# EAGLE board PKG900000001527 (EAGLE 7.7.0)
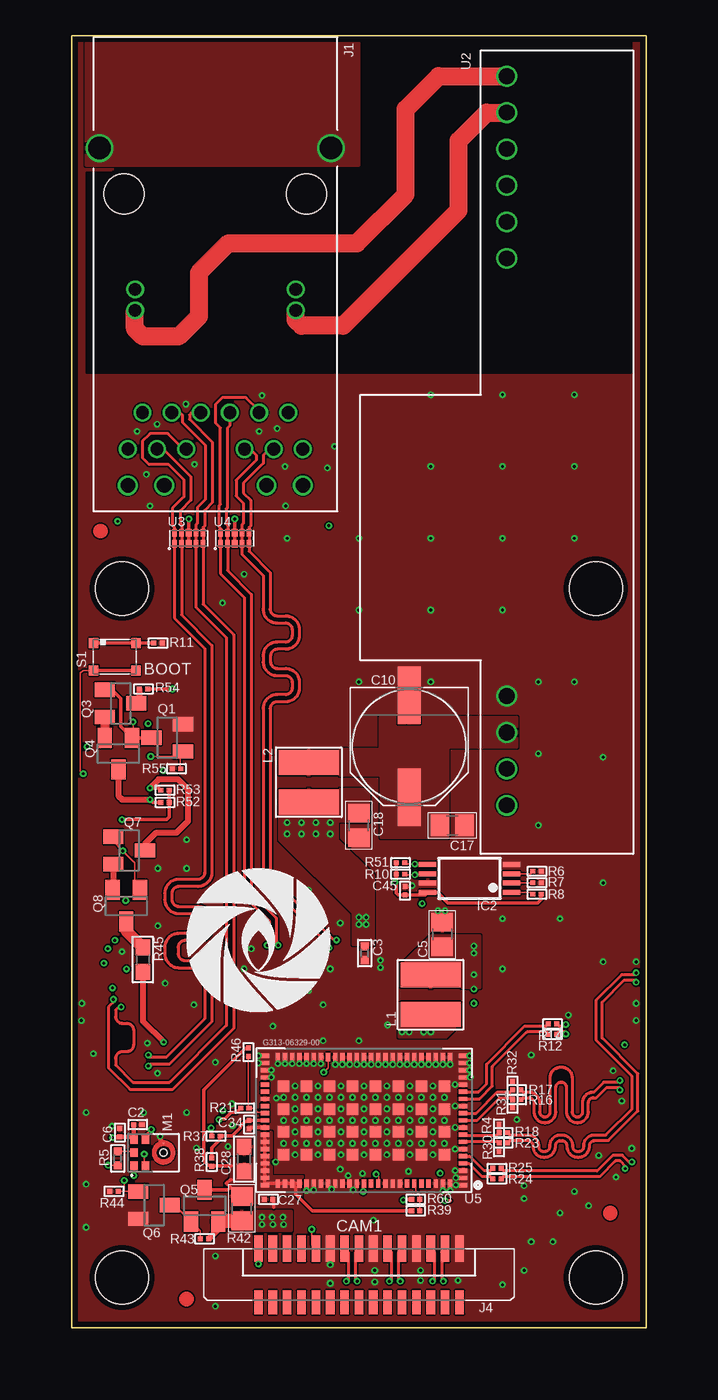
[diagram p8: board, top side]
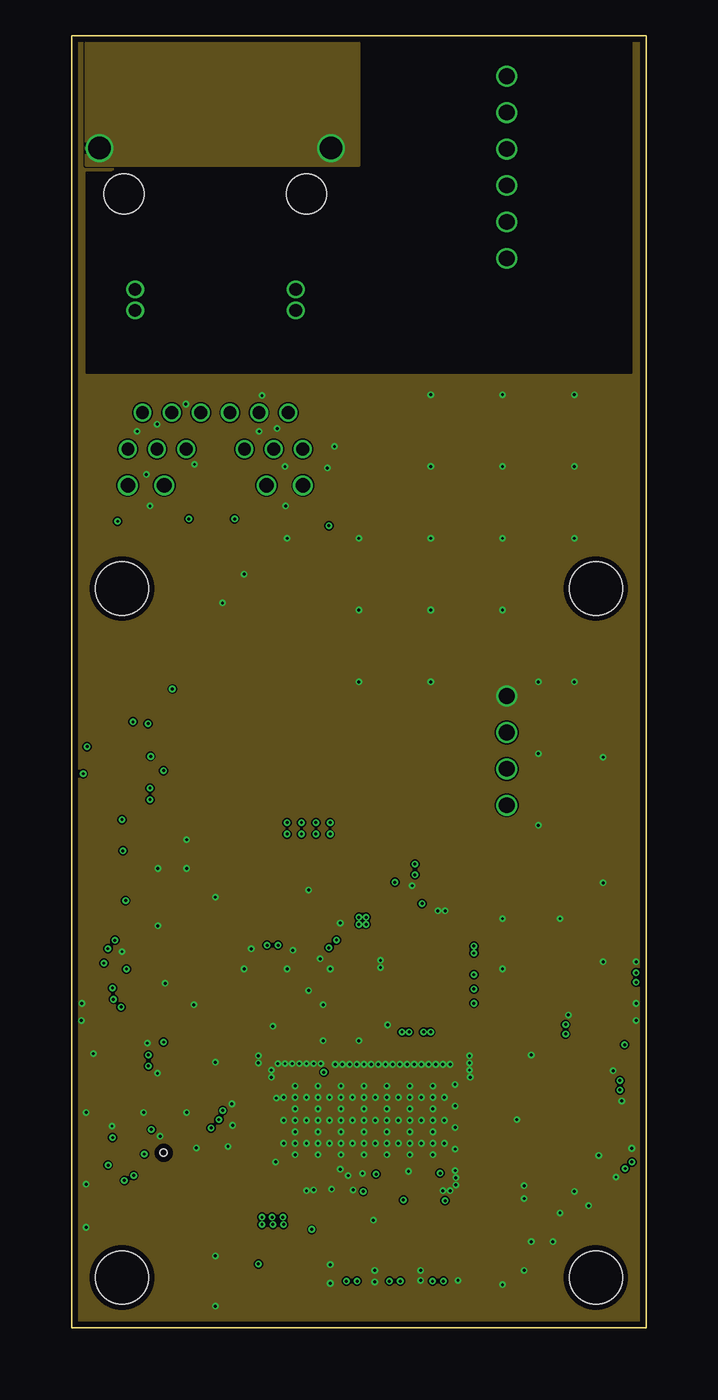
[diagram p9: board, inner layer GND]
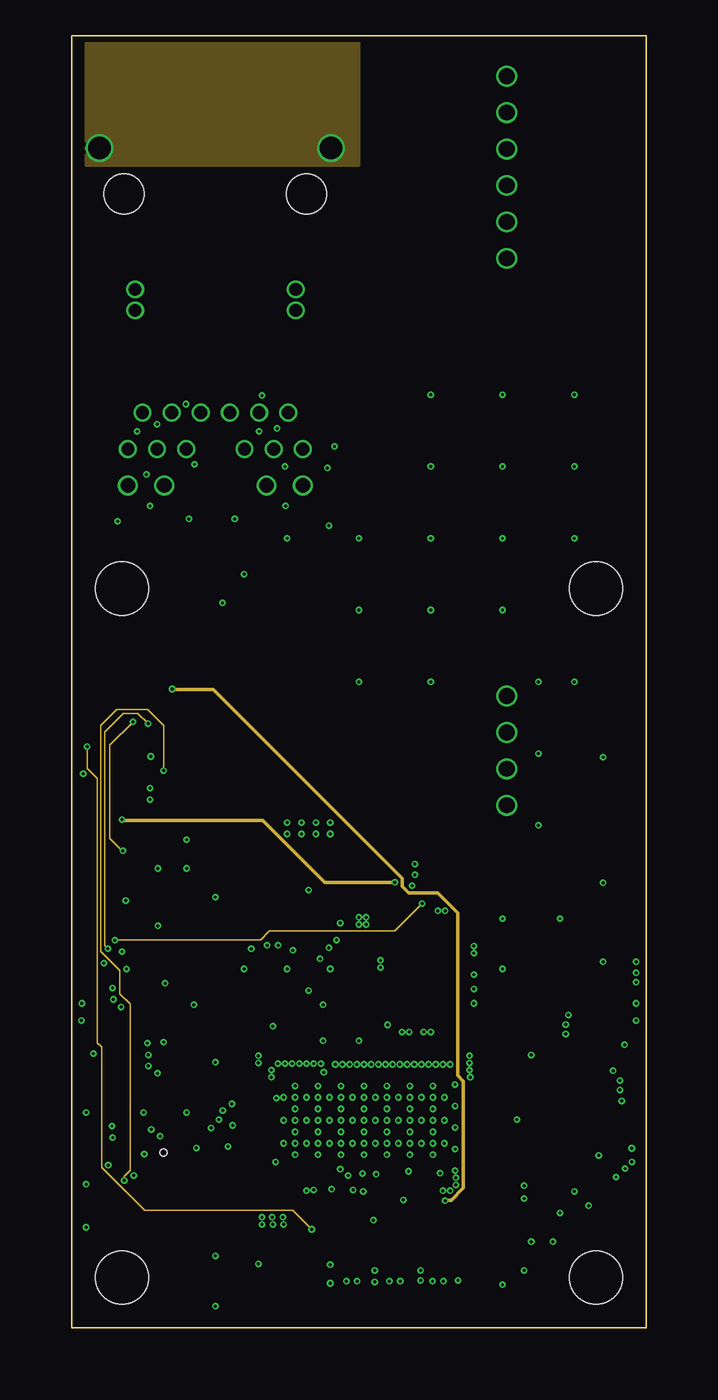
[diagram p10: board, inner layer S3]
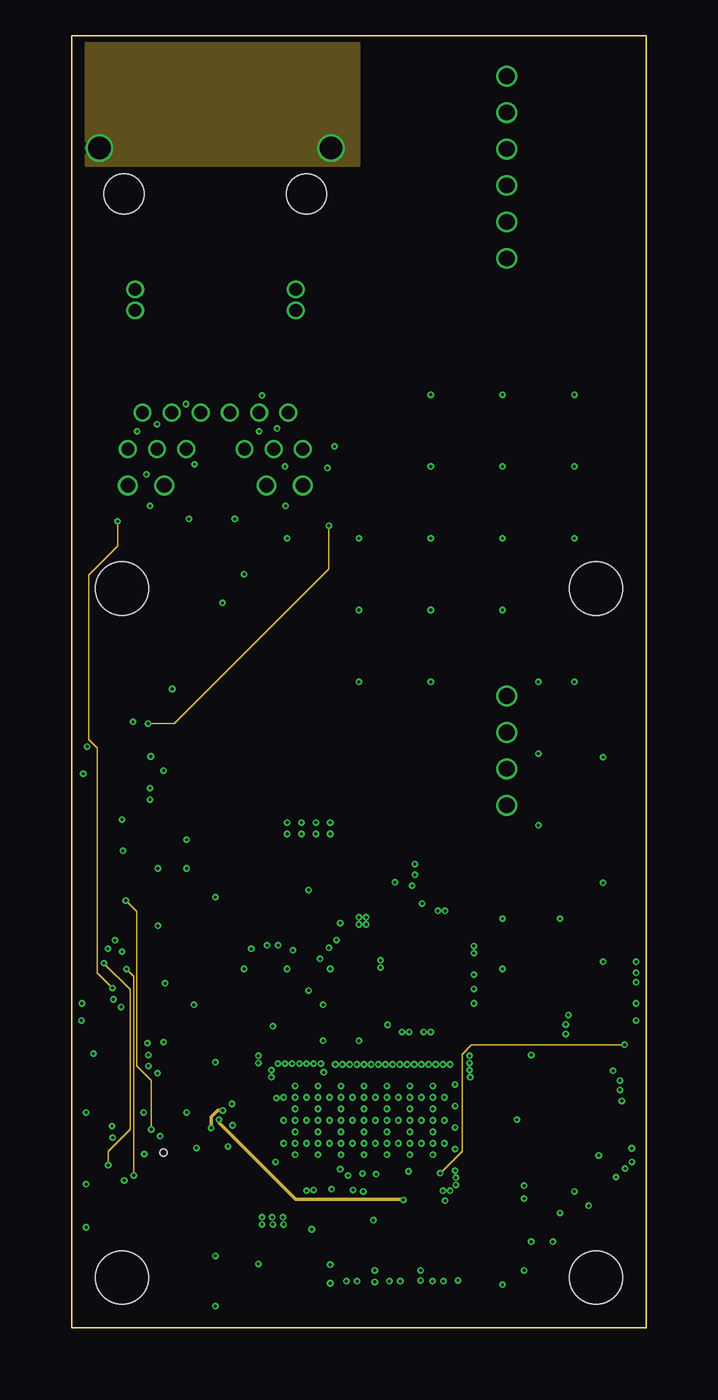
[diagram p11: board, inner layer S14]
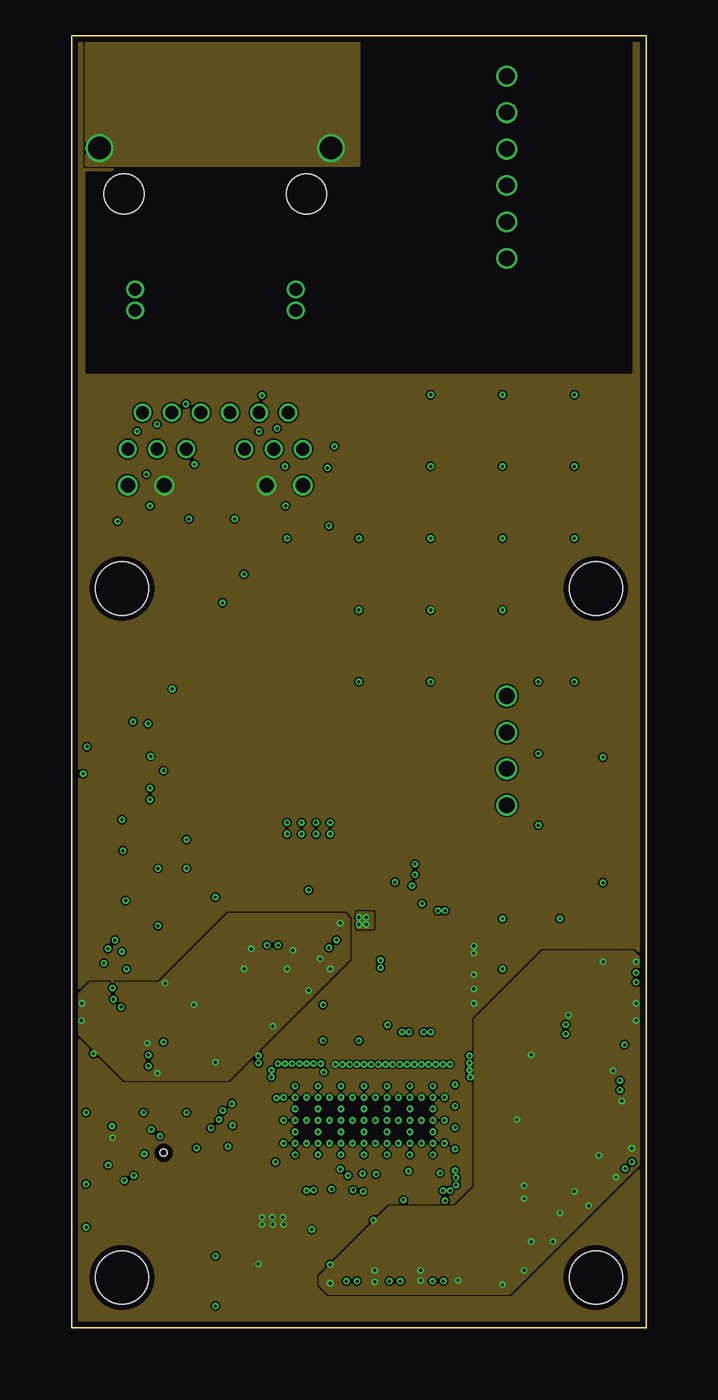
[diagram p12: board, inner layer Power]
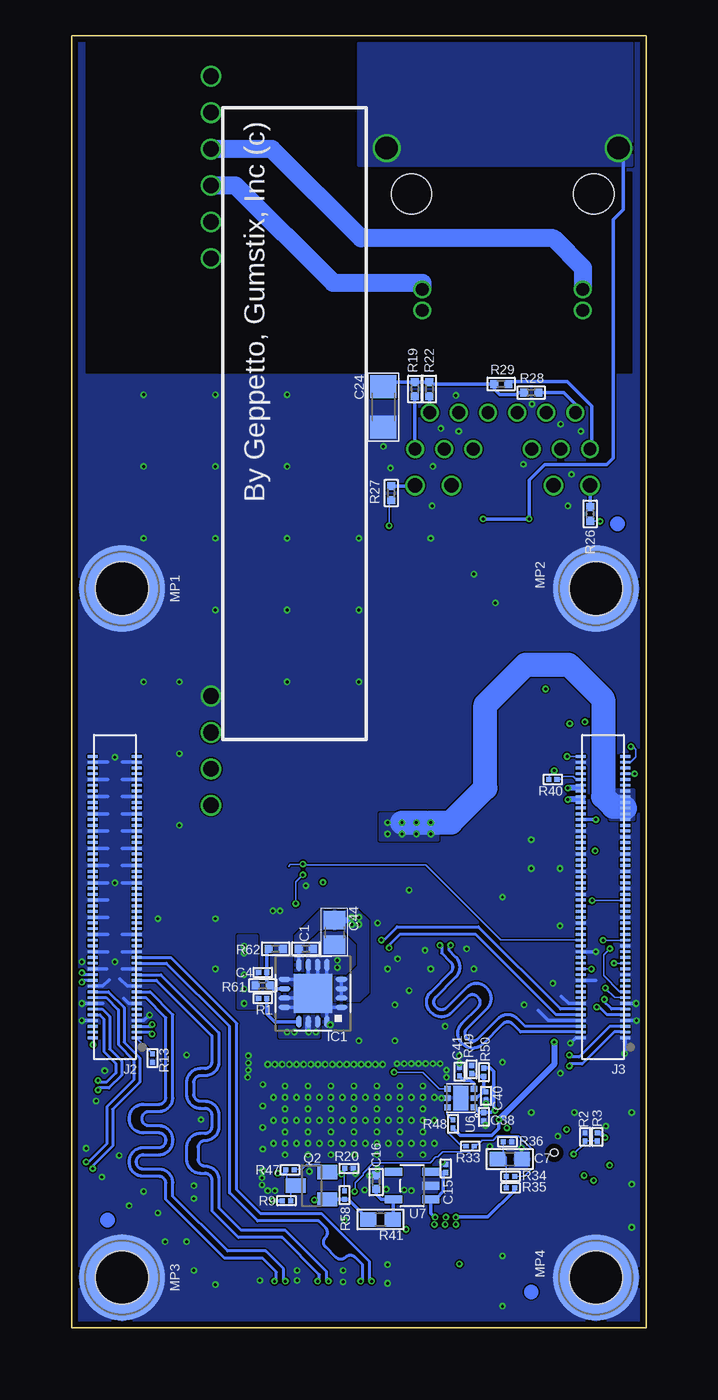
[diagram p13: board, bottom side, seen from below]

Size 40 x 90 mm. Coordinates in mm from the lower left corner, seen from the top.
Outline: 0,0 40,0 40,90 0,90 0,0
Copper layers (1+2*3+14*15+16): Top 0.035mm / dielectric 0.2mm / GND 0.035mm / dielectric 0.2mm / S3 0.035mm / dielectric 0.2mm / S14 0.035mm / dielectric 0.2mm / Power 0.035mm / dielectric 0.2mm / Bottom 0.035mm
Design rules "geppetto": minimum track width 4mil, minimum drill 8mil, track to track 4mil, track to pad 0.15mm, pad to pad 0.15mm, via to via 0.15mm, smd to smd 0mil, copper to edge 15mil, drill to drill 10mil, minimum pad ring 7mil, minimum via ring 5mil, stop-mask expansion 3mil, vias tented up to drill 20mil, thermal gap 0mil
Net classes: 1 supply: width 0.254 mm; 2 analog: width 0.178 mm; 4 xxwide: width 0.203 mm; 5 USB: width 0.2 mm, clearance 0.2 mm; 6 HDMI: width 0.2 mm, clearance 0.3 mm; 7 50_OHM: width 0.378 mm, clearance 0.3 mm
vRestrict: area 12,22 to 21.5,31.5

## Footprints (pad centres in the part's own frame; a part is rotated, then mirrored left to right if it is on the bottom)
0402 = smd 0.559 x 0.559: 1 -0.483,0; 2 0.483,0
0201 = smd 0.356 x 0.33: 1 -0.292,0; 2 0.292,0
0805 = smd 1.3 x 1.5: 1 -0.85,0; 2 0.85,0
0603 = smd 1.1 x 1: 1 -0.85,0; 2 0.85,0
PANASONIC_F = smd 4 x 1.6: + 3.55,0; - -3.55,0
1206 = smd 1.6 x 1.8: 1 -1.4,0; 2 1.4,0
PQFP16 = smd 0.85 x 0.35: 1 -1.975,0.975; 2 -1.975,0.325; 3 -1.975,-0.325; 4 -1.975,-0.975; 9 1.975,-0.975; 10 1.975,-0.325; 11 1.975,0.325; 12 1.975,0.975 | smd 0.35 x 0.85: 5 -0.975,-1.975; 6 -0.325,-1.975; 7 0.325,-1.975; 8 0.975,-1.975; 13 0.975,1.975; 14 0.325,1.975; 15 -0.325,1.975; 16 -0.975,1.975 | smd 2.7 x 2.7: P$1 0,0
TSSOP8 = smd 0.35 x 1.2: 1 -0.975,-2.925; 2 -0.325,-2.925; 3 0.325,-2.925; 4 0.975,-2.925; 5 0.975,2.925; 6 0.325,2.925; 7 -0.325,2.925; 8 -0.975,2.925
7499511440 = drill 0.89: 1 -5.075,-15.24; 2 -3.045,-15.24; 3 -1.015,-15.24; 4 1.015,-15.24; 5 3.045,-15.24; 6 5.075,-15.24; 7 -6.09,-17.78; 8 -4.06,-17.78; 9 -2.03,-17.78; 10 2.03,-17.78; 11 4.06,-17.78; 12 6.09,-17.78; 13 -5.59,-8.12; 14 5.59,-8.12; 15 -5.59,-6.66; 16 5.59,-6.66 | drill 1.02: 17 -6.095,-20.32; 18 -3.555,-20.32; 19 3.555,-20.32; 20 6.095,-20.32 | drill 1.57: SHIELD1 -8.065,3.18; SHIELD2 8.065,3.18 | hole 2.8: 6.35,0; -6.35,0
HRS_DF40C-100DS-0.4V(51) = smd 0.2 x 0.7: 1 -9.8,-1.54; 2 -9.8,1.54; 3 -9.4,-1.54; 4 -9.4,1.54; 5 -9,-1.54; 6 -9,1.54; 7 -8.6,-1.54; 8 -8.6,1.54; 9 -8.2,-1.54; 10 -8.2,1.54; 11 -7.8,-1.54; 12 -7.8,1.54; 13 -7.4,-1.54; 14 -7.4,1.54; 15 -7,-1.54; 16 -7,1.54; 17 -6.6,-1.54; 18 -6.6,1.54; 19 -6.2,-1.54; 20 -6.2,1.54; 21 -5.8,-1.54; 22 -5.8,1.54; 23 -5.4,-1.54; 24 -5.4,1.54; 25 -5,-1.54; 26 -5,1.54; 27 -4.6,-1.54; 28 -4.6,1.54; 29 -4.2,-1.54; 30 -4.2,1.54; 31 -3.8,-1.54; 32 -3.8,1.54; 33 -3.4,-1.54; 34 -3.4,1.54; 35 -3,-1.54; 36 -3,1.54; 37 -2.6,-1.54; 38 -2.6,1.54; 39 -2.2,-1.54; 40 -2.2,1.54; 41 -1.8,-1.54; 42 -1.8,1.54; 43 -1.4,-1.54; 44 -1.4,1.54; 45 -1,-1.54; 46 -1,1.54; 47 -0.6,-1.54; 48 -0.6,1.54; 49 -0.2,-1.54; 50 -0.2,1.54; 51 0.2,-1.54; 52 0.2,1.54; 53 0.6,-1.54; 54 0.6,1.54; 55 1,-1.54; 56 1,1.54; 57 1.4,-1.54; 58 1.4,1.54; 59 1.8,-1.54; 60 1.8,1.54; 61 2.2,-1.54; 62 2.2,1.54; 63 2.6,-1.54; 64 2.6,1.54; 65 3,-1.54; 66 3,1.54; 67 3.4,-1.54; 68 3.4,1.54; 69 3.8,-1.54; 70 3.8,1.54; 71 4.2,-1.54; 72 4.2,1.54; 73 4.6,-1.54; 74 4.6,1.54; 75 5,-1.54; 76 5,1.54; 77 5.4,-1.54; 78 5.4,1.54; 79 5.8,-1.54; 80 5.8,1.54; 81 6.2,-1.54; 82 6.2,1.54; 83 6.6,-1.54; 84 6.6,1.54; 85 7,-1.54; 86 7,1.54; 87 7.4,-1.54; 88 7.4,1.54; 89 7.8,-1.54; 90 7.8,1.54; 91 8.2,-1.54; 92 8.2,1.54; 93 8.6,-1.54; 94 8.6,1.54; 95 9,-1.54; 96 9,1.54; 97 9.4,-1.54; 98 9.4,1.54; 99 9.8,-1.54; 100 9.8,1.54
1-1734248-5 = smd 0.6 x 1.85: 1_1 7,0.025; 1_2 6,0.025; 1_3 5,0.025; 1_4 4,0.025; 1_5 3,0.025; 1_6 2,0.025; 1_7 1,0.025; 1_8 0,0.025; 1_9 -1,0.025; 1_10 -2,0.025; 1_11 -3,0.025; 1_12 -4,0.025; 1_13 -5,0.025; 1_14 -6,0.025; 1_15 -7,0.025 | smd 0.6 x 1.65: 2_1 7,-3.725; 2_2 6,-3.725; 2_3 5,-3.725; 2_4 4,-3.725; 2_5 3,-3.725; 2_6 2,-3.725; 2_7 1,-3.725; 2_8 0,-3.725; 2_9 -1,-3.725; 2_10 -2,-3.725; 2_11 -3,-3.725; 2_12 -4,-3.725; 2_13 -5,-3.725; 2_14 -6,-3.725; 2_15 -7,-3.725
1515 = smd 1.75 x 4.2: 1 -1.375,0; 2 1.375,0
SPH0645 = smd 0.6 x 0.522: 1 -0.9,2.074; 2 -0.9,1.252; 4 0.9,1.252; 5 0.9,2.074; 6 0,2.074 | smd 0.1 x 0.1: 3 0.65,0.02 | hole 0.5: 0,0
WA-SMSI_9774___151 = smd 6 x 6: 1 0,0 | hole 3.7: 0,0
SOT23 = smd 1 x 1.4: 1 -0.95,-1.1; 2 0.95,-1.1; 3 0,1.1
KMT0 = smd 0.65 x 0.7: 1 -1.475,0.95; 2 1.475,0.95; 3 1.475,-0.95; 4 -1.475,-0.95
AG9700 = drill 1.1: 1 1.8,1.8; 2 4.34,1.8; 3 6.88,1.8; 4 9.42,1.8; 5 11.96,1.8; 6 14.5,1.8; 7 44.98,1.8; 8 47.52,1.8; 9 50.06,1.8; 10 52.6,1.8
UFDFN-10 = smd 0.3 x 0.55: 1 -1,-0.385; 2 -0.5,-0.385; 4 0.5,-0.385; 5 1,-0.385; 6 1,0.385; 7 0.5,0.385; 9 -0.5,0.385; 10 -1,0.385 | smd 0.4 x 0.55: 3 0,-0.385; 8 0,0.385
G313-06329-00 = smd 0.6 x 0.3: 1 -6.9,4.5; 2 -6.9,4; 3 -6.9,3.5; 4 -6.9,3; 5 -6.9,2.5; 6 -6.9,2; 7 -6.9,1.5; 8 -6.9,1; 9 -6.9,0.5; 10 -6.9,0; 11 -6.9,-0.5; 12 -6.9,-1; 13 -6.9,-1.5; 14 -6.9,-2; 15 -6.9,-2.5; 16 -6.9,-3; 17 -6.9,-3.5; 18 -6.9,-4; 19 -6.9,-4.5; 45 6.9,-4.5; 46 6.9,-4; 47 6.9,-3.5; 48 6.9,-3; 49 6.9,-2.5; 50 6.9,-2; 51 6.9,-1.5; 52 6.9,-1; 53 6.9,-0.5; 54 6.9,0; 55 6.9,0.5; 56 6.9,1; 57 6.9,1.5; 58 6.9,2; 59 6.9,2.5; 60 6.9,3; 61 6.9,3.5; 62 6.9,4; 63 6.9,4.5 | smd 0.3 x 0.6: 20 -6,-4.4; 21 -5.5,-4.4; 22 -5,-4.4; 23 -4.5,-4.4; 24 -4,-4.4; 25 -3.5,-4.4; 26 -3,-4.4; 27 -2.5,-4.4; 28 -2,-4.4; 29 -1.5,-4.4; 30 -1,-4.4; 31 -0.5,-4.4; 32 0,-4.4; 33 0.5,-4.4; 34 1,-4.4; 35 1.5,-4.4; 36 2,-4.4; 37 2.5,-4.4; 38 3,-4.4; 39 3.5,-4.4; 40 4,-4.4; 41 4.5,-4.4; 42 5,-4.4; 43 5.5,-4.4; 44 6,-4.4; 64 6,4.4; 65 5.5,4.4; 66 5,4.4; 67 4.5,4.4; 68 4,4.4; 69 3.5,4.4; 70 3,4.4; 71 2.5,4.4; 72 2,4.4; 73 1.5,4.4; 74 1,4.4; 75 0.5,4.4; 76 0,4.4; 77 -0.5,4.4; 78 -1,4.4; 79 -1.5,4.4; 80 -2,4.4; 81 -2.5,4.4; 82 -3,4.4; 83 -3.5,4.4; 84 -4,4.4; 85 -4.5,4.4; 86 -5,4.4; 87 -5.5,4.4; 88 -6,4.4 | smd 0.8 x 0.8: 89 -5.6,2.4; 90 -4,2.4; 91 -2.4,2.4; 92 -0.8,2.4; 93 0.8,2.4; 94 2.4,2.4; 95 4,2.4; 96 5.6,2.4; 97 -5.6,0.8; 98 -4,0.8; 99 -2.4,0.8; 100 -0.8,0.8; 101 0.8,0.8; 102 2.4,0.8; 103 4,0.8; 104 5.6,0.8; 105 -5.6,-0.8; 106 -4,-0.8; 107 -2.4,-0.8; 108 -0.8,-0.8; 109 0.8,-0.8; 110 2.4,-0.8; 111 4,-0.8; 112 5.6,-0.8; 113 -5.6,-2.4; 114 -4,-2.4; 115 -2.4,-2.4; 116 -0.8,-2.4; 117 0.8,-2.4; 118 2.4,-2.4; 119 4,-2.4; 120 5.6,-2.4
WDFN6 = smd 0.4 x 0.45: 1 -0.65,-0.925; 2 0,-0.925; 3 0.65,-0.925; 4 0.65,0.925; 5 0,0.925; 6 -0.65,0.925 | smd 1.72 x 1.05: EPAD 0,0
SOT-23-5 = smd 0.55 x 1.2: 1 -0.95,-1.3; 2 0,-1.3; 3 0.95,-1.3; 4 0.95,1.3; 5 -0.95,1.3

## Placement (x,y rotation side)
C1  0.1uF / 16V  [0402]  23.7,26.4 0 bottom
C2  0.1uF  [0201]  4.6,14.15 0 top
C3  1.0uF  [0402]  20.4,26.1 270 top
C4  10pF  [0201]  26.7,24.75 0 bottom
C5  22uF  [0805]  25.8,27.4 90 top
C6  220pF  [0201]  3.35,13.6 90 top
C7  10uF  [0603]  9.5,11.75 0 bottom
C10  470uF  [PANASONIC_F]  23.5,40.5 270 top
C15  DNP  [0201]  13.95,11.1 90 bottom
C16  DNP  [0402]  18.8,10.15 90 bottom
C17  10uF / 16V  [0805]  26.5,35 0 top
C18  10uF / 16V  [0805]  20,35 270 top
C24  1nF 2KV  [1206]  18.3,64.15 270 bottom
C27  0.1uF  [0201]  13.7,8.95 0 top
C28  10uF  [0603]  12,11.75 90 top
C34  0.1uF  [0201]  12.35,14.15 270 top
C38  DNP  [0201]  11.3,14.7 270 bottom
C40  DNP  [0201]  11.15,16.15 270 bottom
C41  DNP  [0201]  13,17.85 90 bottom
C44  10uF / 16V  [0805]  21.7,27.55 270 bottom
C45  0.1uF  [0201]  23.2,30.45 90 top
FD1  DNP  [FIDUCIAL]  8,2 0 top
FD2  DNP  [FIDUCIAL]  2,55.5 0 top
FD3  DNP  [FIDUCIAL]  37.5,8 0 top
FD4  DNP  [FIDUCIAL]  8,2.5 0 bottom
FD5  DNP  [FIDUCIAL]  37.5,7.5 0 bottom
FD6  DNP  [FIDUCIAL]  2,56 0 bottom
IC1  TPS62111  [PQFP16]  23.2,23.3 180 bottom
IC2  CAT24C256YI-G  [TSSOP8]  27.7,31.3 90 top
J1  1000BASET_POE  [7499511440]  10,79 0 top
J2  DF40HC(3.0)-100DS-0.4V(51)  [HRS_DF40C-100DS-0.4V(51)]  37,30 90 bottom
J3  DF40HC(3.0)-100DS-0.4V(51)  [HRS_DF40C-100DS-0.4V(51)]  3,30 90 bottom
J4  FPC-15VERT  [1-1734248-5]  20,5.5 0 top
L1  6.8uH  [1515]  25,23.2 90 top
L2  2.2uH  [1515]  16.5,38 270 top
M1  SPH0645  [SPH0645]  6.4,12.2 90 top
MP1  9774030151R  [WA-SMSI_9774___151]  36.5,51.5 270 bottom
MP2  9774030151R  [WA-SMSI_9774___151]  3.5,51.5 270 bottom
MP3  9774030151R  [WA-SMSI_9774___151]  36.5,3.5 270 bottom
MP4  9774030151R  [WA-SMSI_9774___151]  3.5,3.5 270 bottom
Q1  [SOT23]  6.65,41.1 90 top
Q2  BSS138  [SOT23]  23.3,9.9 90 bottom
Q3  FDN360P  [SOT23]  3.4,43.5 270 top
Q4  FDN360P  [SOT23]  3.25,40 180 top
Q5  FDN360P  [SOT23]  9.25,8.5 0 top
Q6  BSS138  [SOT23]  5.73,8.54 270 top
Q7  FDN360P  [SOT23]  4,33.25 270 top
Q8  FDN360P  [SOT23]  3.8,29.4 180 top
R1  1M0  [0201]  26.7,22.95 180 bottom
R2  0R  [0201]  4.25,13.3 270 bottom
R3  DNP  [0201]  3.4,13.3 90 bottom
R4  0R  [0201]  29.75,13.89 270 top
R5  51R1  [0402]  3.2,11.8 90 top
R6  100K 1%  [0201]  32.4,31.8 180 top
R7  100K 1%  [0201]  32.4,31 180 top
R8  100K 1%  [0201]  32.4,30.2 180 top
R9  10K 1%  [0201]  25.05,8.85 0 bottom
R10  1K5  [0201]  22.9,31.6 180 top
R11  10K 1%  [0201]  6,47.7 180 top
R12  0R  [0201]  33.48,20.44 180 top
R13  0R  [0201]  34.38,18.79 270 bottom
R14  0R  [0201]  33.48,21.17 180 top
R16  DNP  [0201]  30.99,15.89 180 top
R17  DNP  [0201]  30.99,16.57 180 top
R18  DNP  [0201]  30.05,13.59 180 top
R19  75R  [0402]  16.1,65.4 90 bottom
R20  DNP  [0201]  20.7,11.1 180 bottom
R21  DNP  [0201]  12.05,15.3 180 top
R22  75R  [0402]  15.1,65.4 90 bottom
R23  DNP  [0201]  30.05,12.88 180 top
R24  DNP  [0201]  29.61,10.38 180 top
R25  DNP  [0201]  29.61,11.1 180 top
R26  330R  [0402]  3.9,56.7 270 bottom
R27  330R  [0402]  17.75,58.15 270 bottom
R28  75R  [0402]  8,65.15 180 bottom
R29  75R  [0402]  10.1,65.75 180 bottom
R30  0R  [0201]  29.75,12.58 90 top
R31  0R  [0201]  30.69,15.6 90 top
R32  0R  [0201]  30.69,16.87 270 top
R33  DNP  [0201]  12.25,12.65 180 bottom
R34  0R  [0201]  9.45,10.55 180 bottom
R35  100K 1%  [0201]  9.45,9.75 0 bottom
R36  100K 1%  [0201]  9.65,12.95 180 bottom
R37  DNP  [0201]  10.05,13.35 0 top
R38  0R  [0201]  9.75,11.55 270 top
R39  3K9  [0201]  23.95,8.15 0 top
R40  0R  [0201]  6.5,38.2 180 bottom
R41  DNP  [0603]  18.5,7.55 180 bottom
R42  DNP  [0805]  11.85,8.3 270 top
R43  10K 1%  [0201]  9.25,6.2 180 top
R44  10K 1%  [0201]  2.95,9.5 180 top
R45  0R  [0603]  4.95,25.65 270 top
R46  0R  [0201]  12.3,19.2 90 top
R47  DNP  [0201]  24.8,11 180 bottom
R48  DNP  [0201]  13.45,14.2 270 bottom
R49  DNP  [0201]  12.15,18 270 bottom
R50  DNP  [0201]  11.3,17.8 90 bottom
R51  1K5  [0201]  22.9,32.4 180 top
R52  0R  [0201]  6.5,36.6 0 top
R53  DNP  [0201]  6.5,37.45 0 top
R54  0R  [0201]  5,44.5 180 top
R55  10K 1%  [0201]  7.3,38.95 0 top
R58  10K 1%  [0201]  21,9.25 90 bottom
R60  DNP  [0201]  23.95,8.95 180 top
R61  0R  [0402]  26.7,23.85 180 bottom
R62  DNP  [0402]  25.8,26.4 180 bottom
S1  EVQ  [KMT0]  3,46.75 0 top
U2  AG9705-2BR  [AG9700]  28.5,89 270 top
U3  TPD4E02B0410-USON  [UFDFN-10]  8.15,55 0 top
U4  TPD4E02B0410-USON  [UFDFN-10]  11.35,55 0 top
U5  G313-06329-00  [G313-06329-00]  20.35,14.45 180 top
U6  DNP  [WDFN6]  12.9,16 90 bottom
U7  DNP  [SOT-23-5]  16.3,9.9 90 bottom
U$2  DNP  [GEPPETTO_LABEL]  29.5,85 270 bottom
U$3  DNP  [GEPPETTO_LOGO_SILK10]  13,27 0 top

## Tracks (layer width: path | path; a pad name or v marks a point on that pad's centre or on a via)
1.8V_OUT$1  (via drill 0.2)
  Top 0.254: v5.45,37.6 6.06,37.6 R53.1
  Top 0.406: Q7.3 5.1,33.7 5.9,34.5 7.3,34.5 8.1,35.3 8.1,37.5 7.4,38.2 6.05,38.2 v5.45,37.6
  Bottom 0.254: 4.54,37.6 J3.88 J3.90
  Bottom 0.406: 4.54,37.6 v5.45,37.6
1.8V_OUT_CM4
  Top 0.813: Q8.3 3.8,27.65 R45.1
1.1000BASET_LINK_1000  (via drill 0.2)
  S3 0.102: v2.52,26.41 2.29,26.64 2.29,41.52 3.58,42.81 4.6,42.81 v5.32,42.09
  S14 0.102: v5.32,42.09 7.15,42.09 17.9,52.84 v17.9,55.88
  Bottom 0.102: J3.17 1.82,23.4 2.96,24.54 2.96,25.97 v2.52,26.41 | v17.9,55.88 17.9,57.52 R27.2
1.1000BASET_LINK_ACT  (via drill 0.2)
  S14 0.102: v3.2,56.19 3.2,54.46 1.17,52.43 1.17,41 1.78,40.39 1.78,24.73 v2.83,23.67
  Bottom 0.102: v3.2,56.19 3.86,56.19 R26.2 | 1.47,23.01 J3.15 2.18,23 2.83,23.66 v2.83,23.67
1.1000BASET_TR0_N  (via drill 0.2)
  Top 0.2: J1.10 12.42,61.22 12.84,60.8 12.84,60.44 11.45,59.05 11.45,57.95 11.95,57.45 11.95,56.05 11.85,55.95 U4.7 U4.4 11.85,53.89 13.32,52.42 13.32,50.08 arc90 14.29,49.1 14.88,49.1 arc-90 15.36,48.63 15.36,48.24 arc-90 14.88,47.77 14.29,47.77 arc90 13.32,46.79 13.32,46.41 arc90 14.29,45.44 14.88,45.44 arc-90 15.36,44.96 15.36,44.58 arc-90 14.88,44.1 14.29,44.1 arc90 13.32,43.13 13.32,31.24 17.99,26.56 v17.9,26.47
  Bottom 0.2: J3.10 6.26,21.8 11.89,27.43 17.13,27.43 17.99,26.56 v17.9,26.47
1.1000BASET_TR0_P  (via drill 0.2)
  Top 0.2: J1.11 13.76,61.22 13.34,60.8 13.34,60.24 11.95,58.85 11.95,58.15 12.45,57.65 12.45,55.85 12.35,55.75 U4.6 U4.5 12.35,54.09 13.82,52.62 13.82,50.08 arc90 14.29,49.6 14.88,49.6 arc-90 15.86,48.63 15.86,48.24 arc-90 14.88,47.27 14.32,47.27 arc90 13.84,46.79 13.84,46.41 arc90 14.32,45.94 14.88,45.94 arc-90 15.86,44.96 15.86,44.58 arc-90 14.88,43.6 14.29,43.6 arc90 13.82,43.13 13.82,31.44 18.35,26.92 v18.44,27.01
  Bottom 0.2: J3.12 5.96,22.2 11.69,27.93 17.33,27.93 18.35,26.92 v18.44,27.01
1.1000BASET_TR1_N  (via drill 0.2)
  Top 0.2: J1.5 13.04,63.9 12.13,64.81 10.49,64.81 10,64.32 10,63.05 10.35,62.7 10.35,57.35 10.25,57.25 10.25,55.8 10.35,55.7 U4.10 U4.1 10.35,52.55 12.01,50.89 12.01,30.07 13.74,28.34 13.74,26.64 v13.61,26.64
  Bottom 0.2: J3.6 8.43,21 8.95,21.52 arc-90 10.33,21.52 11.74,20.11 arc90 12.41,20.11 12.47,20.18 arc90 12.47,20.85 11.06,22.26 arc-90 11.06,23.64 11.13,23.7 arc-90 12.51,23.7 13.92,22.29 arc90 14.59,22.29 14.65,22.36 arc90 14.65,23.03 13.24,24.44 arc-90 13.24,25.82 13.74,26.31 13.74,26.64 v13.61,26.64
1.1000BASET_TR1_P  (via drill 0.2)
  Top 0.2: J1.4 11.02,62.87 10.85,62.7 10.85,57.15 10.75,57.05 10.75,56 10.85,55.9 U4.9 U4.2 10.85,52.75 12.51,51.09 12.51,30.27 14.24,28.54 14.24,26.64 v14.37,26.64
  Bottom 0.2: J3.4 8.73,20.6 9.3,21.17 arc-90 9.97,21.17 11.38,19.76 arc90 12.76,19.76 12.83,19.82 arc90 12.83,21.2 11.7,22.33 arc-90 11.7,23.01 11.76,23.07 arc-90 12.43,23.07 13.56,21.94 arc90 14.94,21.94 15.01,22 arc90 15.01,23.38 13.6,24.79 arc-90 13.6,25.46 14.24,26.11 14.24,26.64 v14.37,26.64
1.1000BASET_TR2_N  (via drill 0.2)
  Top 0.2: J1.2 7.53,63.76 7.7,63.59 7.7,63.09 9.3,61.49 9.3,57.7 8.75,57.15 8.75,56.05 8.65,55.95 U3.7 U3.4 8.65,50.21 10.77,48.09 10.77,21.05 6.82,17.1 4.26,17.1 3.05,18.31 3.05,18.76 arc-90 3.52,19.23 3.83,19.23 arc90 4.31,19.71 4.31,20.73 arc90 3.83,21.21 3.52,21.21 arc-90 3.05,21.68 3.05,22.14 3.35,22.43 v3.44,22.34
  Bottom 0.2: J3.9 2.71,21.8 3.35,22.43 v3.44,22.34
1.1000BASET_TR2_P  (via drill 0.2)
  Top 0.2: J1.3 8.37,63.76 8.2,63.59 8.2,63.29 9.8,61.69 9.8,57.5 9.25,56.95 9.25,55.85 9.15,55.75 U3.6 U3.5 9.15,50.41 11.27,48.29 11.27,20.85 7.02,16.6 4.06,16.6 2.55,18.11 2.55,22.34 2.99,22.79 v2.9,22.88
  Bottom 0.2: J3.11 2.41,22.2 2.99,22.79 v2.9,22.88
1.1000BASET_TR3_N  (via drill 0.2)
  Top 0.2: J1.9 7.78,61.22 6.7,62.3 5.45,62.3 4.92,61.77 4.92,60.6 4.93,60.6 5.37,60.16 6.73,60.16 7.8,59.09 7.8,57.9 7,57.1 7,55.9 7.15,55.75 U3.10 U3.1 7.15,49.45 9.26,47.34 9.26,31.72 arc-90 8.79,31.24 7.45,31.24 arc90 6.48,30.27 6.48,29.83 arc90 7.45,28.86 8.79,28.86 arc-90 9.26,28.38 9.26,27.95 arc-90 8.79,27.47 7.45,27.47 arc90 6.48,26.5 6.48,26.06 arc90 7.45,25.09 8.79,25.09 arc-90 9.26,24.61 9.26,21.52 6.61,18.87 5.34,18.87 v5.34,19
  Bottom 0.2: J3.5 2.53,21 4.66,18.87 5.34,18.87 v5.34,19
1.1000BASET_TR3_P  (via drill 0.2)
  Top 0.2: J1.8 6.37,61.22 8.3,59.29 8.3,57.65 7.55,56.9 7.55,56.05 7.65,55.95 U3.9 U3.2 7.65,49.65 9.76,47.54 9.76,31.72 arc-90 8.79,30.74 7.45,30.74 arc90 6.98,30.27 6.98,29.83 arc90 7.45,29.36 8.79,29.36 arc-90 9.76,28.38 9.76,27.95 arc-90 8.79,26.97 7.89,26.97 arc90 7.41,26.5 7.41,26.06 arc90 7.89,25.59 8.79,25.59 arc-90 9.76,24.61 9.76,21.32 6.81,18.37 5.34,18.37 v5.34,18.24
  Bottom 0.2: J3.3 2.23,20.6 4.46,18.37 5.34,18.37 v5.34,18.24
1.AUDIO_ACLKX  (via drill 0.2)
  Top 0.102: v5.54,13.82 5.18,13.46 5.18,13.11 M1.4
  S14 0.102: v5.54,13.82 5.54,17.22 4.52,18.24 4.52,29.01 v3.76,29.77
  Bottom 0.102: v3.76,29.77 1.47,29.77 J3.49
1.AUDIO_AXR1  (via drill 0.2)
  Top 0.102: v2.54,11.33 3.15,11.33 R5.1
  S14 0.102: v2.54,11.33 2.54,12.29 4.06,13.82 4.06,23.57 v2.23,25.4
  Bottom 0.102: J3.27 v2.23,25.4
1.AUDIO_FSX  (via drill 0.2)
  Top 0.102: v4.32,10.62 4.32,11.28 M1.1
  S14 0.102: v4.32,10.62 4.32,24.49 v3.81,24.99
  Bottom 0.102: v3.81,24.99 4.52,24.99 J3.26
1.CAM1_C_N  (via drill 0.2)
  Top 0.2: J4.1_8 20,5.5 19.75,5.25 19.75,3.25 v19.88,3.25
  Bottom 0.2: v19.88,3.25 19.75,3.25 19.75,4.4 20.26,4.91 arc-90 20.94,4.91 arc90 21.61,4.91 22.33,5.63 arc90 22.33,6.3 arc-90 22.33,6.97 22.8,7.45 27.05,7.45 29,9.4 29,21 33.4,25.4 J2.27
1.CAM1_C_P  (via drill 0.2)
  Top 0.2: J4.1_9 19,5.5 19.25,5.25 19.25,3.25 v19.12,3.25
  Bottom 0.2: v19.12,3.25 19.25,3.25 19.25,4.6 22.6,7.95 26.85,7.95 28.5,9.6 28.5,21.2 33.1,25.8 J2.29
1.CAM1_D1_N  (via drill 0.2)
  Top 0.2: J4.1_2 25.75,5.28 25.75,3.25 v25.88,3.25
  Bottom 0.2: v25.88,3.25 25.75,3.25 25.75,3.9 26.7,4.85 29.35,4.85 33.45,8.95 33.45,10.08 arc-90 33.92,10.55 35.02,10.55 arc90 35.99,11.53 35.99,11.58 arc90 35.02,12.56 33.92,12.56 arc-90 33.45,13.03 33.45,13.09 arc-90 33.92,13.57 35.02,13.57 arc90 35.99,14.54 35.99,14.6 arc90 35.02,15.57 33.92,15.57 arc-90 33.45,16.05 33.45,21.6 34.85,23 J2.15
1.CAM1_D1_P  (via drill 0.2)
  Top 0.2: J4.1_3 25.25,5.28 25.25,3.25 v25.12,3.25
  Bottom 0.2: v25.12,3.25 25.25,3.25 25.25,4.1 26.5,5.35 29.15,5.35 32.95,9.15 32.95,10.08 arc-90 33.92,11.05 35.02,11.05 arc90 35.49,11.53 35.49,11.58 arc90 35.02,12.06 33.92,12.06 arc-90 32.95,13.03 32.95,13.09 arc-90 33.92,14.07 34.62,14.07 arc90 35.1,14.54 35.1,14.6 arc90 34.62,15.07 33.92,15.07 arc-90 32.95,16.05 32.95,21.8 34.55,23.4 J2.17
1.CAM1_D2_N  (via drill 0.2)
  Top 0.2: J4.1_5 22.75,5.28 22.75,3.25 v22.88,3.25
  Bottom 0.2: v22.88,3.25 22.75,3.25 22.75,3.7 25.35,6.3 28.4,6.3 30.25,8.15 30.25,10.3 arc-90 30.73,10.78 31.04,10.78 arc90 32.01,11.75 32.01,12.56 arc90 31.04,13.54 30.73,13.54 arc-90 30.25,14.01 30.25,14.82 arc-90 30.73,15.29 31.04,15.29 arc90 32.01,16.27 32.01,17.08 arc90 31.04,18.05 30.73,18.05 arc-90 30.25,18.53 30.25,20.35 34.1,24.2 J2.21
1.CAM1_D2_P  (via drill 0.2)
  Top 0.2: J4.1_6 22.25,5.28 22.25,3.25 v22.12,3.25
  Bottom 0.2: v22.12,3.25 22.25,3.25 22.25,3.9 25.15,6.8 28.2,6.8 29.75,8.35 29.75,10.3 arc-90 30.73,11.28 arc90 31.2,11.75 31.2,12.56 arc90 30.73,13.04 arc-90 29.75,14.01 29.75,14.82 arc-90 30.73,15.79 31.04,15.79 arc90 31.51,16.27 31.51,17.08 arc90 31.04,17.55 30.73,17.55 arc-90 29.75,18.53 29.75,20.55 33.8,24.6 J2.23
1.GPIO_CAMERA_GPIO  (via drill 0.2)
  Top 0.102: v16.71,6.86 16.71,5.79 16.97,5.54 J4.1_11
  S3 0.102: v1.07,40.49 1.07,38.96 1.78,38.25 1.78,19.86 2.08,19.56 2.08,11.18 5.08,8.18 15.39,8.18 v16.71,6.86
  Bottom 0.102: v1.07,40.49 0.91,40.49 0.71,40.28 0.71,39.78 1.07,39.42 1.42,39.42 J3.97
1.PCIE__CLK_N
  Top 0.2: U5.10 28.22,14.45 29.8,16.03 30.56,16.03 R16.2 R31.2
1.PCIE__CLK_P
  Top 0.2: U5.11 28.16,14.95 29.64,16.43 30.56,16.43 R17.2 R32.2
1.PCIE_CLK_N  (via drill 0.2)
  Top 0.2: v38.17,16.57 38.17,16.7 37.21,16.7 36.54,16.03 36.33,16.03 arc90 35.98,15.68 35.98,15.04 arc-90 35.23,14.29 35.2,14.29 arc-90 34.45,15.04 34.45,16.75 arc90 34.1,17.1 34.06,17.1 arc90 33.72,16.75 33.72,15.04 arc-90 32.97,14.29 32.93,14.29 arc-90 32.18,15.04 32.18,15.68 arc90 31.83,16.03 31.42,16.03 R16.1
  Bottom 0.2: J2.12 37.88,22.2 37.36,21.68 37.36,19.41 36.53,18.58 36.53,17.59 37.42,16.7 38.17,16.7 v38.17,16.57
1.PCIE_CLK_P  (via drill 0.2)
  Top 0.2: v38.17,17.23 38.17,17.1 37.05,17.1 36.38,16.43 36.33,16.43 arc90 35.58,15.68 35.58,15.04 arc-90 35.23,14.69 35.2,14.69 arc-90 34.85,15.04 34.85,17.42 arc90 34.1,18.17 34.06,18.17 arc90 33.31,17.42 33.31,15.04 arc-90 32.97,14.69 32.93,14.69 arc-90 32.58,15.04 32.58,15.68 arc90 31.83,16.43 31.42,16.43 R17.1 31.28,16.55
  Bottom 0.2: J2.10 38.04,21.8 37.76,21.52 37.76,19.25 36.93,18.42 36.93,17.75 37.58,17.1 38.17,17.1 v38.17,17.23
1.PCIE_CLKREQ_GPIO  (via drill 0.2)
  S14 0.102: v38.51,19.71 27.84,19.71 27.18,19.05 27.18,12.29 v25.65,10.77
  Bottom 0.102: R9.2 24.74,8.89 24.74,9.55 24.43,9.86 Q2.3 24.74,9.6 25.04,9.91 25.04,10.77 | 25.04,10.77 25.04,10.97 R47.2 | v38.51,19.71 38.51,20.17 J2.2 | 25.04,10.77 v25.65,10.77
1.PCIE_RX0_N  (via drill 0.2)
  Top 0.2: v38.54,11.09 38.63,11.18 38.19,11.62 37.85,11.62 36.75,10.52 30.04,10.52 R24.1
  Bottom 0.2: J2.18 37.45,23.4 36.36,22.31 36.36,19.89 35.27,18.8 35.27,17.11 37.15,15.23 37.15,12.66 38.63,11.18 v38.54,11.09
1.PCIE_RX0_P  (via drill 0.2)
  Top 0.2: v39,11.55 38.91,11.46 38.35,12.02 37.69,12.02 36.59,10.92 30.08,10.92 R25.1
  Bottom 0.2: J2.16 37.61,23 36.76,22.15 36.76,19.73 35.67,18.64 35.67,17.27 37.55,15.39 37.55,12.82 38.91,11.46 v39,11.55
1.PCIE_TX0_N  (via drill 0.2)
  Top 0.2: v39.3,24.73 39.3,24.6 38.29,24.6 36.53,22.84 36.53,20.02 39.02,17.53 39.02,15.26 37.2,13.44 36.41,13.44 arc90 35.66,12.69 35.66,12.64 arc-90 35.31,12.29 35.23,12.29 arc-90 34.88,12.64 34.88,12.69 arc90 34.13,13.44 34.04,13.44 arc90 33.29,12.69 33.29,12.64 arc-90 32.94,12.29 32.86,12.29 arc-90 32.51,12.64 32.51,12.69 arc90 31.76,13.44 30.49,13.44 R18.1
  Bottom 0.2: J2.24 39.3,24.6 v39.3,24.73
1.PCIE_TX0_P  (via drill 0.2)
  Top 0.2: v39.3,24.07 39.3,24.2 38.45,24.2 36.93,22.68 36.93,20.18 39.42,17.69 39.42,15.1 37.36,13.04 36.41,13.04 arc90 36.06,12.69 36.06,12.64 arc-90 35.31,11.89 35.23,11.89 arc-90 34.48,12.64 34.48,12.69 arc90 34.13,13.04 34.04,13.04 arc90 33.69,12.69 33.69,12.64 arc-90 32.94,11.89 32.86,11.89 arc-90 32.11,12.64 32.11,12.69 arc90 31.76,13.04 30.5,13.04 R23.1
  Bottom 0.2: J2.22 39.3,24.2 v39.3,24.07
1.USB_OTG_ID
  Bottom 0.102: R13.1 34.39,19.1 35.46,20.17 J2.1
1.VLOGIC_VLOGIC  (via drill 0.2)
  Top 0.254: R54.1 v7,44.5 | v26,8.85 26.35,8.85
  S3 0.254: v26,8.85 26.01,8.89 26.42,8.89 27.28,9.75 27.28,17.17 26.87,17.58 26.87,28.91 25.5,30.28 23.47,30.28 23.01,30.73 23.01,31.29 9.86,44.45 7.01,44.45 v7,44.5
  Bottom 0.254: R9.1 v26,8.85
3.3.3V_VCC_3.3  (via drill 0.2)
  Top 0.254: J4.1_15 v13,4.45
  Top 0.305: C2.1 4.31,13.12 M1.5 4.12,13.31 C6.1 3.29,13.25 v2.85,13.25
  Top 0.406: Q5.2 10.2,6.86 R43.1
  Top 1.016: R42.2 10.25,7.45 Q5.2
  Bottom 0.254: 13.99,10.85 C15.1 14.07,10.82 14.12,10.82 | 14.12,10.82 14.99,10.82 U7.3 | R35.2 9.2,9.7 9.2,9.55 11.02,7.72 13.21,7.72 v13.25,7.7 | v14.7,7.7 14.73,7.72 14.99,7.98 14.99,8.94 U7.1 14.88,8.99 14.63,8.99 14.12,9.5 14.12,10.82
  Bottom 0.305: v2.85,13.25 3.19,13.59 R3.2
  other vias: 28,22.6 28,23.6 28,24.6 28,26.1 28,26.6 14.75,7.2 14,7.2 13.25,7.2 13.95,7.7
  pour Top: 23.1,23.7 28.4,23.7 28.4,27.3 25.03,27.3 23.1,25.37
  pour Bottom: 27.1,22.3 28.4,22.3 28.4,27.3 27.1,27.3
  pour Power (rank 2): 1,59.5 39,59.5 39,33 1,33
  pour Power (rank 6): 0,0 0,90 40,90 40,0
  pour Top: 11.1,6.8 11.1,8.1 15.3,8.1 15.3,6.8
3.3V
  Top 0.254: U5.56 U5.63 13.45,10.05 U5.64 U5.65 U5.66 | U5.67 U5.66 | R39.1 16.75,8.15 15.6,9.3 15.6,9.8 U5.66 | 11.1,11.28 9.75,11.28 R38.2 9.65,11.33 9.5,11.33 9.2,11.63 9.2,16.56 12.09,19.46 12.29,19.46 R46.2 | Q5.3 9.3,9.6 10.87,9.6 11.02,9.75 11.02,9.8 10.77,10.06 11.02,10.31 11.1,10.31
  pour Top: 11.1,11.8 12.8,11.8 12.8,13.6 13.9,13.6 13.9,10.5 16.1,10.5 16.1,9.3 13.6,9.3 13.6,8.7 11.1,8.7
3.3V_OUT$1  (via drill 0.2)
  Top 0.254: v5.45,36.8 5.65,36.6 R52.1
  Top 0.406: Q4.3 3.25,37.05 3.5,36.8 v5.45,36.8
  Bottom 0.254: 4.54,36.8 J3.86 J3.84 4.34,36.8
  Bottom 0.406: 4.54,36.8 v5.45,36.8
3.3V_SWITCH$1
  Top 0.406: R54.2 4.71,43.71 Q3.3
5.5.0V_VCC_5.0  (via drill 0.2, 0.2 pad 0.25)
  Bottom 0.254: 24.15,25.3 IC1.8 C1.1 | IC1.2 IC1.3 IC1.4
  Bottom 0.406: C44.1 20.7,28.4 v20.5,28.6
  Bottom 1.676: v17,35.2 15.4,35.2 | J3.81 1.56,36.3 2.3,36.3 3,37 3,43.8 5.4,46.2 8.4,46.2 11.2,43.4 11.2,37.6 13.6,35.2 v15,35.2
  other vias: 20,28.1 20,28.6 20.5,28.1 15,34.4 16,35.2 16,34.4 17,34.4 18,34.4 18,35.2
  pour Bottom: 24.4,24.8 23.9,24.8 23.9,26.74 22.84,27.8 21.03,27.8 20,26.77 20,25.18 20.78,24.4 21.7,24.4 21.7,22.8 19.97,22.8 19.4,23.37 19.4,28.33 20.12,29.05 22.66,29.05 24.4,27.31
  pour Power: 20.95,27.85 19.9,27.85 19.9,28.9 20.95,28.9
  pour Top: 20.95,28.9 20.95,26.7 19.9,26.7 19.9,28.9
  pour Top: 14.55,37.5 20.65,37.5 20.65,35.3 18.5,35.3 18.5,34 14.55,34
  pour Bottom (rank 3): 2.5,37.45 0.85,37.45 0.85,35.4 2.5,35.4
  pour Bottom: 18.5,34 14.5,34 14.5,35.8 18.5,35.8
  pour Top: 14.5,37.5 14.5,34 19.6,28.9 19.6,26.7 21,26.7 21,31.5 18.5,34 18.5,35.3 20.7,35.3 20.7,37.5
!EXTRST$1  (via drill 0.2)
  Top 0.102: v5.5,39.8 7.4,39.8 Q1.1 7.57,39.93 7.57,38.96 R55.2
  Bottom 0.102: J3.100 v5.5,39.8
!PCIE_CLKREQ$2  (via drill 0.2)
  Top 0.102: v21.2,10.7 21.35,10.55 21.39,10.52 21.39,10.06 U5.78
  Bottom 0.102: v21.2,10.7 22.05,10.7 Q2.2 22.25,10.87 22.76,11.38 23.62,11.38 23.98,11.02 24.49,11.02 R47.1 | R20.2 20.99,10.91 v21.2,10.7 | R58.2 21.03,9.55 21.03,10.82 v21.2,10.7
!RPIBOOT$1  (via drill 0.2)
  Top 0.102: v0.8,38.6 0.6,38.8 0.6,45.6 0.8,45.8 S1.4
  Top 0.254: S1.4 S1.3
  Bottom 0.102: J3.93 v0.8,38.6
!RST$2  (via drill 0.2)
  Top 0.102: U5.76 20.3,10 v20.3,9.5
  Bottom 0.102: 20.3,9.55 v20.3,9.5 20.27,9.55 20.27,10.11 19.71,10.67 19.71,10.77 19,11.48 15.09,11.48 15.05,11.5 14.65,11.9 14.5,11.9 14.48,11.94 14.17,12.24 12.29,12.24 11.99,12.55 11.99,12.65 R33.1 11.94,12.7 11.78,12.7 11.42,13.06 10.66,13.06 10.36,13.36 8.89,13.36 7.87,12.34 7.87,11.18 8.48,10.57 9.14,10.57 R34.1
!RST_DELAY$2
  Bottom 0.102: U6.6 13.9,15.28 13.9,14.9 13.8,14.8 | 13.8,14.8 13.49,14.49 R48.1 | R33.2 12.55,12.7 12.9,12.7 13.82,13.61 13.82,14.78 13.8,14.8
A0$1
  Top 0.102: IC2.1 31.98,30.32 R8.2
A1$1
  Top 0.102: IC2.2 32.08,30.98 R7.2
A2$1
  Top 0.102: IC2.3 31.93,31.62 R6.2
AON
  Top 0.254: U5.54 C34.1 12.24,14.38 12.09,14.38 11.73,14.02 11.73,13.92 11.18,13.36 10.46,13.36 R37.2 10.31,13.31 10.31,13.11 9.75,12.55 9.75,11.89 R38.1
BTM_CUTOUT$5
  cutout Bottom: 1,80.5 20.5,80.5 20.5,89.5 39,89.5 39,66.5 1,66.5
COMMON_SHIELD  (via drill 0.2)
  Top 0.254: U3.3 U3.8 v8.15,56.35 | U4.3 U4.8 v11.35,56.35
  Bottom 0.254: v11.35,56.35 v8.15,56.35 8.15,59.05 7.05,60.15 2.75,60.15 2.3,60.6 2.3,77.2 1.6,77.9 1.6,81.84 J1.SHIELD1
  pour Top: 1,89.5 1,81 20,81 20,89.5
  pour GND: 1,89.5 1,81 20,81 20,89.5
  pour S3: 1,89.5 1,81 20,81 20,89.5
  pour S14: 1,89.5 1,81 20,81 20,89.5
  pour Power: 1,89.5 1,81 20,81 20,89.5
  pour Bottom: 1,89.5 1,81 20,81 20,89.5
CORAL_D__N
  Top 0.2: R14.2 33.19,21.16 33.03,21 31.53,21 28.89,18.36 28.89,17 28.34,16.45 U5.14
CORAL_D__P
  Top 0.2: R12.2 33.03,20.6 31.69,20.6 29.29,18.2 29.29,16.84 28.4,15.95 U5.13
CORAL_D_N  (via drill 0.2)
  Top 0.2: v34.4,21.13 34.4,21 33.94,21 R14.1
  Bottom 0.2: J2.5 34.4,21 v34.4,21.13
CORAL_D_P  (via drill 0.2)
  Top 0.2: v34.4,20.47 34.4,20.6 33.93,20.6 R12.1
  Bottom 0.2: J2.3 34.4,20.6 v34.4,20.47
CT0$5
  Top 1.27: U2.1 25.55,87.2 23.25,84.9 23.25,78.95 19.85,75.55 10.9,75.55 8.85,73.5 8.85,70.45 7.45,69.05 4.95,69.05 4.4,69.6 J1.13
CT1$2
  Bottom 0.254: C41.1 12.69,17.25 12.25,17.25 11.97,16.98 U6.3
CT1$5
  Top 1.27: U2.2 28.9,84.65 26.95,82.7 26.95,77.85 18.9,69.8 16,69.8 15.59,70.21 J1.14
CT2$5
  Bottom 1.27: U2.3 26.07,82.12 19.85,75.9 6.45,75.9 4.4,73.85 J1.15
CT3$5
  Bottom 1.27: U2.4 28.58,79.58 21.8,72.8 15.59,72.8 J1.16
DS_LOAD$1
  Top 0.61: Q3.2 Q4.2
DS_LOAD_1V8$1
  Top 0.406: Q7.2 2.9,30.55 Q8.2
FB_3.3$3
  Bottom 0.254: IC1.10 25.99,23.62 R61.1 26.41,24.04 C4.2 26.41,26.27 R62.2
FET_ENABLE
  Top 0.102: R43.2 8.94,6.25 8.94,6.76 8.33,7.37 Q5.1 8.28,7.42 7.16,8.53 6.86,8.53 Q6.3
GND  (via drill 0.2, 0.2 pad 0.25, 0.2 pad 0.41)
  Top 0.254: C45.2 23.64,30.74 v23.7,30.8 | C27.2 14.05,8.89 14.05,8.4 | U5.55 13.41,13.97 12.5,13.97 12.39,13.87 C34.2
  Top 0.305: M1.3 6.15,13.08 v6.15,13.35
  Bottom 0.254: J3.32 v3.5,26.2 | J3.22 3.5,24.2 | J2.25 36.5,25 | J2.31 36.5,26.2 | J2.26 37.55,25 | J2.32 37.5,26.2 | J2.38 37.5,27.4 | J2.44 37.5,28.6 | J2.37 36.5,27.4 | J2.50 37.5,29.8 | J2.56 37.5,31 | J2.62 37.5,32.2 | J2.55 36.5,31 | J2.61 36.5,32.2 | J2.67 36.5,33.4 | J2.68 37.5,33.4 | J2.74 37.5,34.6 | J2.73 36.5,34.6 | J2.79 36.5,35.8 | J2.85 36.5,37 | J2.91 36.5,38.2 | J2.92 37.5,38.2 | J2.86 37.5,37 | J2.80 37.5,35.8 | J2.98 37.5,39.4 | J2.97 36.5,39.4 | C38.2 11.2,14.31 v11.2,14.1 | C16.2 18.8,10.95 v18.7,11.05 | C15.2 14.04,11.39 v14.2,11.55 | IC1.11 23.2,22.98 IC1.P$1 | IC1.12 23.2,22.32 IC1.P$1 | 22.23,22.32 IC1.16 | 22.23,22.32 IC1.1 | IC1.P$1 22.23,22.32 | IC1.9 24.18,24.27 23.65,23.75 | 23.65,23.75 IC1.P$1 | IC1.7 23.52,23.88 23.65,23.75 | 22.88,23.9 22.88,23.62 IC1.P$1 | 22.88,23.9 IC1.6 | IC1.5 22.23,24.55 22.88,23.9 | J2.20 37.85,23.8 37.4,24.25 | 37.85,22.6 J2.14 v39.3,22.6 | J2.19 36.15,23.8 36.65,24.3 | J3.7 v0.67,21.4 | J2.13 36.03,22.6 36.38,22.95 | J2.7 34.97,21.4 v34.58,21.79 | J3.2 4.9,20.2 v5.27,19.83 | J3.8 6.8,21.4 7.5,22.1 | J3.14 5.4,22.6 5.9,23.1 | J2.8 v39.3,21.4 | J3.13 v0.7,22.6 | J3.1 1.46,19.14 v1.5,19.1 | 21.49,25.6 v21.5,25.6 21.49,25.6
  other vias: 37,39.75 37,31 11.15,15.6 20.35,14.45 19.55,14.45 18.75,14.45 18.75,13.65 18.75,12.85 18.75,12.05 18.75,15.25 18.75,16.05 18.75,16.85 17.95,14.45 17.15,14.45 17.15,13.65 17.15,12.85 17.15,12.05 17.95,12.85 16.35,14.45 15.55,14.45 14.75,14.45 15.55,13.65 15.55,12.85 15.55,12.05 16.35,12.85 14.75,12.85 15.55,15.25 15.55,16.05 15.55,16.85 14.75,16.05 19.55,12.85 20.35,12.85 20.35,12.05 20.35,13.65 20.35,15.25 20.35,16.05 20.35,16.85 19.55,16.05 21.15,12.85 21.95,12.85 21.95,12.05 21.95,13.65 21.95,14.45 21.15,14.45 21.95,15.25 21.95,16.05 21.15,16.05 21.95,16.85 22.75,16.05 23.55,16.05 23.55,15.25 23.55,14.45 22.75,14.45 23.55,13.65 23.55,12.85 22.75,12.85 23.55,12.05 17.15,15.25 17.15,16.05 17.95,16.05 16.35,16.05 17.15,16.85 23.55,16.85 24.35,16.05 25.15,16.05 25.15,16.85 25.15,15.25 25.15,14.45 24.35,14.45 25.15,13.65 25.15,12.85 25.15,12.05 24.35,12.85 25.95,12.85 25.95,14.45 25.95,16.05 26.35,18.35 25.85,18.35 25.35,18.35 24.85,18.35 24.35,18.35 23.85,18.35 27.7,18.95 27.7,18.45 27.7,17.95 27.75,17.45 26.69,16.95 23.35,18.35 22.85,18.35 22.35,18.35 21.85,18.35 21.35,18.35 20.85,18.35 20.35,18.35 19.85,18.35 19.35,18.35 18.85,18.35 18.35,18.35 17.35,18.4 16.85,18.4 16.35,18.4 15.85,18.4 15.35,18.4 14.85,18.4 14.35,18.4 13,18.95 13,18.45 13.9,17.95 13.9,17.45 26.7,15.45 26.7,13.95 26.7,12.45 26.7,10.95 26.75,10.45 26.75,9.95 26.35,9.55 25.85,9.55 20.25,10.75 19.6,9.6 16.85,9.6 18.1,9.65 16.35,9.55 14.25,16 19.25,10.6 23.45,10.9 26,29.05 25.5,29.05 21.5,25.1 22,21.1 18,4.4 18.3,61.4 17.8,59.9 13.05,62.45 14.85,60 14.3,62.65 5.2,59.45 14.9,57.25 5.95,62.95 7.95,64.35 8.55,60.15 4.55,62.45 13.25,64.95 5.45,57.25 2.8,14.05 8.68,12.53 10.88,12.63 12.5,26.4 15.4,26.3 17.3,25.7 18.7,28.2 5.97,17.73 37.7,17.9 38.3,15.8 39,12.5 37.9,10.5 24.3,3.3 26.9,3.3 24.3,4 21.1,4 21.1,3.2 18,3.1 39.3,25.5 10,1.5 10,5 1,7 1,10 1,15 5,15 8,15 10,18.5 8.5,22.5 14,21 16.5,23.5 15,25 6.5,24 18,25 12,25 37,25.5 32,19 31,14.5 36,8.5 33.5,6 31.5,4 30,3 31.5,9 31.5,9.9 21,7.5 35,9.5 34,8 32,6 20,20 16.5,30.5 10,30 6,28 6,32 10.5,50.5 12,52.5 15,55 25,55 30,55 35,55 25,60 30,60 35,60 25,65 35,65 30,65 20,50 20,45 25,45 25,50 20,55 30,50 35,45 32.5,45 32.5,40 32.5,35 30,25 30,28.5 34,28.5 17.5,20 17.5,22.5 8,34 8,32 36.7,12
  pour Top (rank 6): 0,0 0,90 40,90 40,0
  pour GND (rank 6): 0,0 0,90 40,90 40,0
  pour Bottom (rank 6): 0,0 0,90 40,90 40,0
  pour Bottom (rank 5): 39.5,33.5 39.5,0.5 0.5,0.5 0.5,33.5
  pour Top (rank 5): 39.5,33.5 39.5,0.5 0.5,0.5 0.5,33.5
  pour Bottom (rank 4): 29.5,19.3 10.5,19.3 10.5,8.2 29.5,8.2
  pour GND: 29.5,19.3 10.5,19.3 10.5,8.2 29.5,8.2
  pour Top (rank 4): 29.5,19.3 10.5,19.3 10.5,8.2 29.5,8.2
  pour Bottom (rank 2): 22.3,20.9 20.7,20.9 20.7,22.4 22.1,22.4 22.1,24.7 20.92,24.7 20.35,25.27 20.35,26.61 21.04,27.3 22.84,27.3 23.6,26.54 23.6,24.4 24.7,24.4 24.7,26.7 25.6,26.7 25.7,22 22.3,22
  pour Top (rank 2): 19,29.6 28.5,29.6 28.5,20.1 19,20.1
  pour Top (rank 6): 9,1 31,1 31,6.5 9,6.5
  pour Bottom: 9,1 31,1 31,6.5 9,6.5
  pour Bottom (rank 6): 39,66 39,33 1,33 1,66
  pour Top (rank 3): 39,66 39,33 1,33 1,66
  pour Top (rank 6): 2.5,10.5 2.5,14.5 7.5,14.5 7.5,10.5
  pour Bottom (rank 6): 2.5,10.5 2.5,14.5 7.5,14.5 7.5,10.5
  pour Power: 5.5,17.3 10.9,17.3 13.8,20.2 19.3,25.7 19.3,28.5 19,28.8 16.9,28.8 10.9,28.8 6.1,24 1.3,24 0.5,23.2 0.5,20.5 3.7,17.3
  pour Power: 17.9,2.4 17.3,3 17.3,3.6 22.1,8.4 26.7,8.4 28.1,9.8 28.1,21.5 32.8,26.2 39.1,26.2 39.5,25.8 39.5,11.4 30.7,2.6 30.6,2.5 30.5,2.4
GND_CUTOUT$5
  cutout GND: 1,80.5 20.5,80.5 20.5,89.5 39,89.5 39,66.5 1,66.5
GPIO_VREF$1  (via drill 0.2)
  Top 0.254: v3.5,35.4 6.6,35.4 6.8,35.6 R52.2 R53.2 | R8.1 32.65,30.16 32.65,29.8 32.45,29.6 26.2,29.6 25.48,30.32 IC2.8 24.61,30.16 C45.1 22.74,30.16 22.6,30.3 22.6,31.04 | R51.2 R10.2 22.6,31.04 | v22.5,31.04 22.6,31.04
  S3 0.254: v22.5,31.04 17.63,31.04 13.31,35.36 3.5,35.36 v3.5,35.4
  Bottom 0.254: J3.78 v3.5,35.4
ID_SC$1  (via drill 0.2)
  Top 0.102: IC2.6 24.7,31.55 v23.9,31.55 23.24,31.55 R10.1
  S3 0.102: v3,27 3.05,27.03 13.16,27.03 13.77,27.64 22.5,27.64 24.38,29.52 v24.4,29.55
  Bottom 0.102: J3.35 v3,27 | v24.4,29.55 24.4,31.05 v23.9,31.55
ID_SD$1  (via drill 0.2)
  Top 0.102: IC2.5 24.75,32.3 v23.9,32.3 23.29,32.3 R51.1
  Bottom 0.102: 24.9,32.15 IC2.5 23.93,32.27 v23.9,32.3 23.88,32.26 15.34,32.26 10.11,27.03 4.57,27.03 J3.36
LOAD_GATE$1  (via drill 0.2)
  Top 0.102: Q7.1 2.9,33.9 3.57,33.23 | 3.57,33.23 4.4,32.4 4.4,30.85 Q8.1 | v4.27,42.22 4.27,41.2 Q4.1 | v3.56,33.22 3.57,33.23
  Top 0.254: Q1.3 Q4.1 3.4,41.9 3.4,43.85 2.8,44.45 Q3.1
  S3 0.102: v3.56,33.22 3.5,33.22 2.64,34.09 2.64,40.59 v4.27,42.22
MFA0_R$5
  Bottom 0.254: R27.1 16.14,58.63 J1.20
MFA1_R$5
  Bottom 0.254: R26.1 J1.17
PCIE_RX_N
  Top 0.2: U5.8 27.3,13.4 29.55,13.4 R4.2 R18.2
PCIE_RX_P
  Top 0.2: U5.7 27.3,13 29.62,13 R30.2 R23.2
PCIE_TX_N
  Top 0.2: U5.4 27.65,11.45 28.54,10.56 29.14,10.56 R24.2
PCIE_TX_P
  Top 0.2: U5.5 27.71,11.95 28.7,10.96 29.18,10.96 R25.2
PG_3.3$3
  Bottom 0.254: IC1.13 25.88,21.32 26.41,21.86 R1.1
PGOOD4$2  (via drill 0.2)
  Top 0.102: U5.37 17.85,18.1 v17.55,17.8
  Bottom 0.102: v17.55,17.8 15.55,17.8 14.4,16.65 U6.4
PMIC_EN$2
  Top 0.102: U5.53 13.4,15 12.95,15 12.65,15.3 R21.1 12.29,15.34 12.29,18.9 R46.1
PWR_CUTOUT$5
  cutout Power: 1,80.5 20.5,80.5 20.5,89.5 39,89.5 39,66.5 1,66.5
RPIBOOT_SWITCH$1
  Top 0.254: S1.1 S1.2 R11.2
RST_RC$
  Bottom 0.102: R35.1 9.75,9.75 9.75,10.52 R34.2 9.75,10.57 9.75,11.89 9.96,12.09 C7.1 10.31,11.79 9.96,12.14 9.96,12.9 R36.2
RUN_PG  (via drill 0.2)
  Top 0.102: 3.66,9.5 Q6.1 | 3.66,9.5 3.25,9.5 R44.1 | 3.66,9.5 v3.66,10.26
  S3 0.102: v6.4,38.81 6.4,41.96 5.28,43.08 3.13,43.08 2.01,41.96 2.01,26.23 3.35,24.89 3.35,23.27 4.06,22.55 4.06,10.97 3.66,10.57 v3.66,10.26
  Bottom 0.102: v6.4,38.81 6.76,38.46 6.76,38.2 R40.2
RUN_PG$
  Bottom 0.102: R40.1 6.2,38.2 5.99,38.2 5.79,38.41 5.08,38.41 4.88,38.2 4.57,38.2 J3.92
S3_CUTOUT$5
  cutout S3: 1,80.5 20.5,80.5 20.5,89.5 39,89.5 39,66.5 1,66.5
S14_CUTOUT$5
  cutout S14: 1,80.5 20.5,80.5 20.5,89.5 39,89.5 39,66.5 1,66.5
SDI$7
  Top 0.102: M1.6 4.24,12.28 R5.2
SELECT$7  (via drill 0.2)
  Top 0.102: M1.2 5.05,11.4 v5.05,12.1
  Bottom 0.102: v5.05,12.1 4.25,12.9 R2.2 R3.1
SENSE$2
  Bottom 0.254: R49.2 12.09,17.65 11.9,17.65 11.76,17.51 R50.1 11.3,16.59 C40.1 11.36,16.44 11.8,16 U6.2
SW_3.3$3  (via drill 0.2 pad 0.25)
  Bottom 0.254: v23.5,20.6 23.52,20.6
  Bottom 0.406: 23.52,20.6 IC1.14
  other vias: 24.5,20.6 23,20.6 25,20.6
  pour Top: 22.8,20.25 26.08,20.25 27,21.17 27,22.6 22.8,22.6
  pour Bottom: 22.8,21.7 25.5,21.7 25.5,20.25 22.8,20.25
TOP_CUTOUT$5
  cutout Top: 1,80.5 20.5,80.5 20.5,89.5 39,89.5 39,66.5 1,66.5
TRDXCT0$5
  Bottom 0.254: R19.1 J1.12
TRDXCT1$5
  Bottom 0.254: 15.1,63.78 J1.6 15.07,64.92 R22.1
TRDXCT2$5
  Bottom 0.254: 4.92,64.22 J1.1 4.9,63.78 4.9,64.3 5.75,65.15 R28.1
TRDXCT3$5
  Bottom 0.254: J1.7 3.88,61.22 3.8,61.3 3.8,64.2 5.5,65.9 9.62,65.9 R29.1
TRDXCT_COMMON$5
  Bottom 0.254: R22.2 R19.2 17.97,65.88 C24.1 | 15.07,65.85 R22.2 | R28.2 8.85,65.15 9,65 10.2,65 10.58,65.38 R29.2 14.97,65.75 R22.2
USB_SEL$2
  Top 0.102: U5.83 23.95,9.95 23.95,9.55 24.24,9.26 R60.1 24.23,8.18 R39.2
V1.8$2  (via drill 0.2)
  Top 0.254: R21.2 11.46,15 11.1,15 10.65,14.55 10.3,14.55 v10.25,14.5 | R60.2 23.15,8.95 v23.1,8.9
  Top 0.406: R45.2 4.95,21.35 v6.4,19.9
  S14 0.254: v10.25,14.5 10.26,14.48 10.26,14.28 15.6,8.94 23.06,8.94 v23.1,8.9
  Bottom 0.254: v23.1,8.9 23.05,8.95 Q2.1 R58.1 20.76,8.96 R41.2 | v10.25,14.5 10.25,13.9 10.75,13.4 12.95,13.4 13.4,13.85 13.46,13.92 R48.2
  Bottom 0.406: v6.4,19.9 6.4,18.35 v10.25,14.5
V1.8_OUT$2
  Bottom 0.254: C16.1 18.8,9.3 18.45,8.95 U7.5 17.6,7.6 R41.1
V3.3_UNFILT$5
  pour Top: 14.5,38.5 21.55,38.5 21.55,34.15 26.2,34.15 26.2,40.45 31,40.45 31,42.5 21.5,42.5 21.5,40.3 14.5,40.3
VLOGIC  (via drill 0.2)
  Top 0.254: v9.7,13.92 9.75,13.87 R37.1
  S14 0.254: v9.7,13.92 9.7,14.68 10.16,15.14 v10.52,15.14
  Bottom 0.254: R50.2 10.85,18.1 10.6,17.85 10.6,15.2 | U6.1 11.62,14.99 C38.1 | 10.6,15.2 10.8,15 C38.1 | 11.24,15.05 C38.1 | v10.52,15.14 10.6,15.2

## Text on the board
tPlace: BOOT | CAM1